# Altium schematic sheet 05_LMS7002M_RF1.SchDoc: LMS7002M RF
size A3; Organization: Lime Microsystems; Address1: Surrey Tech Centre; Address2: Guildford GU2 7YG; Address3: Surrey; Address4: United Kingdom; Revision: v1.4; SheetNumber: 5; SheetTotal: 15
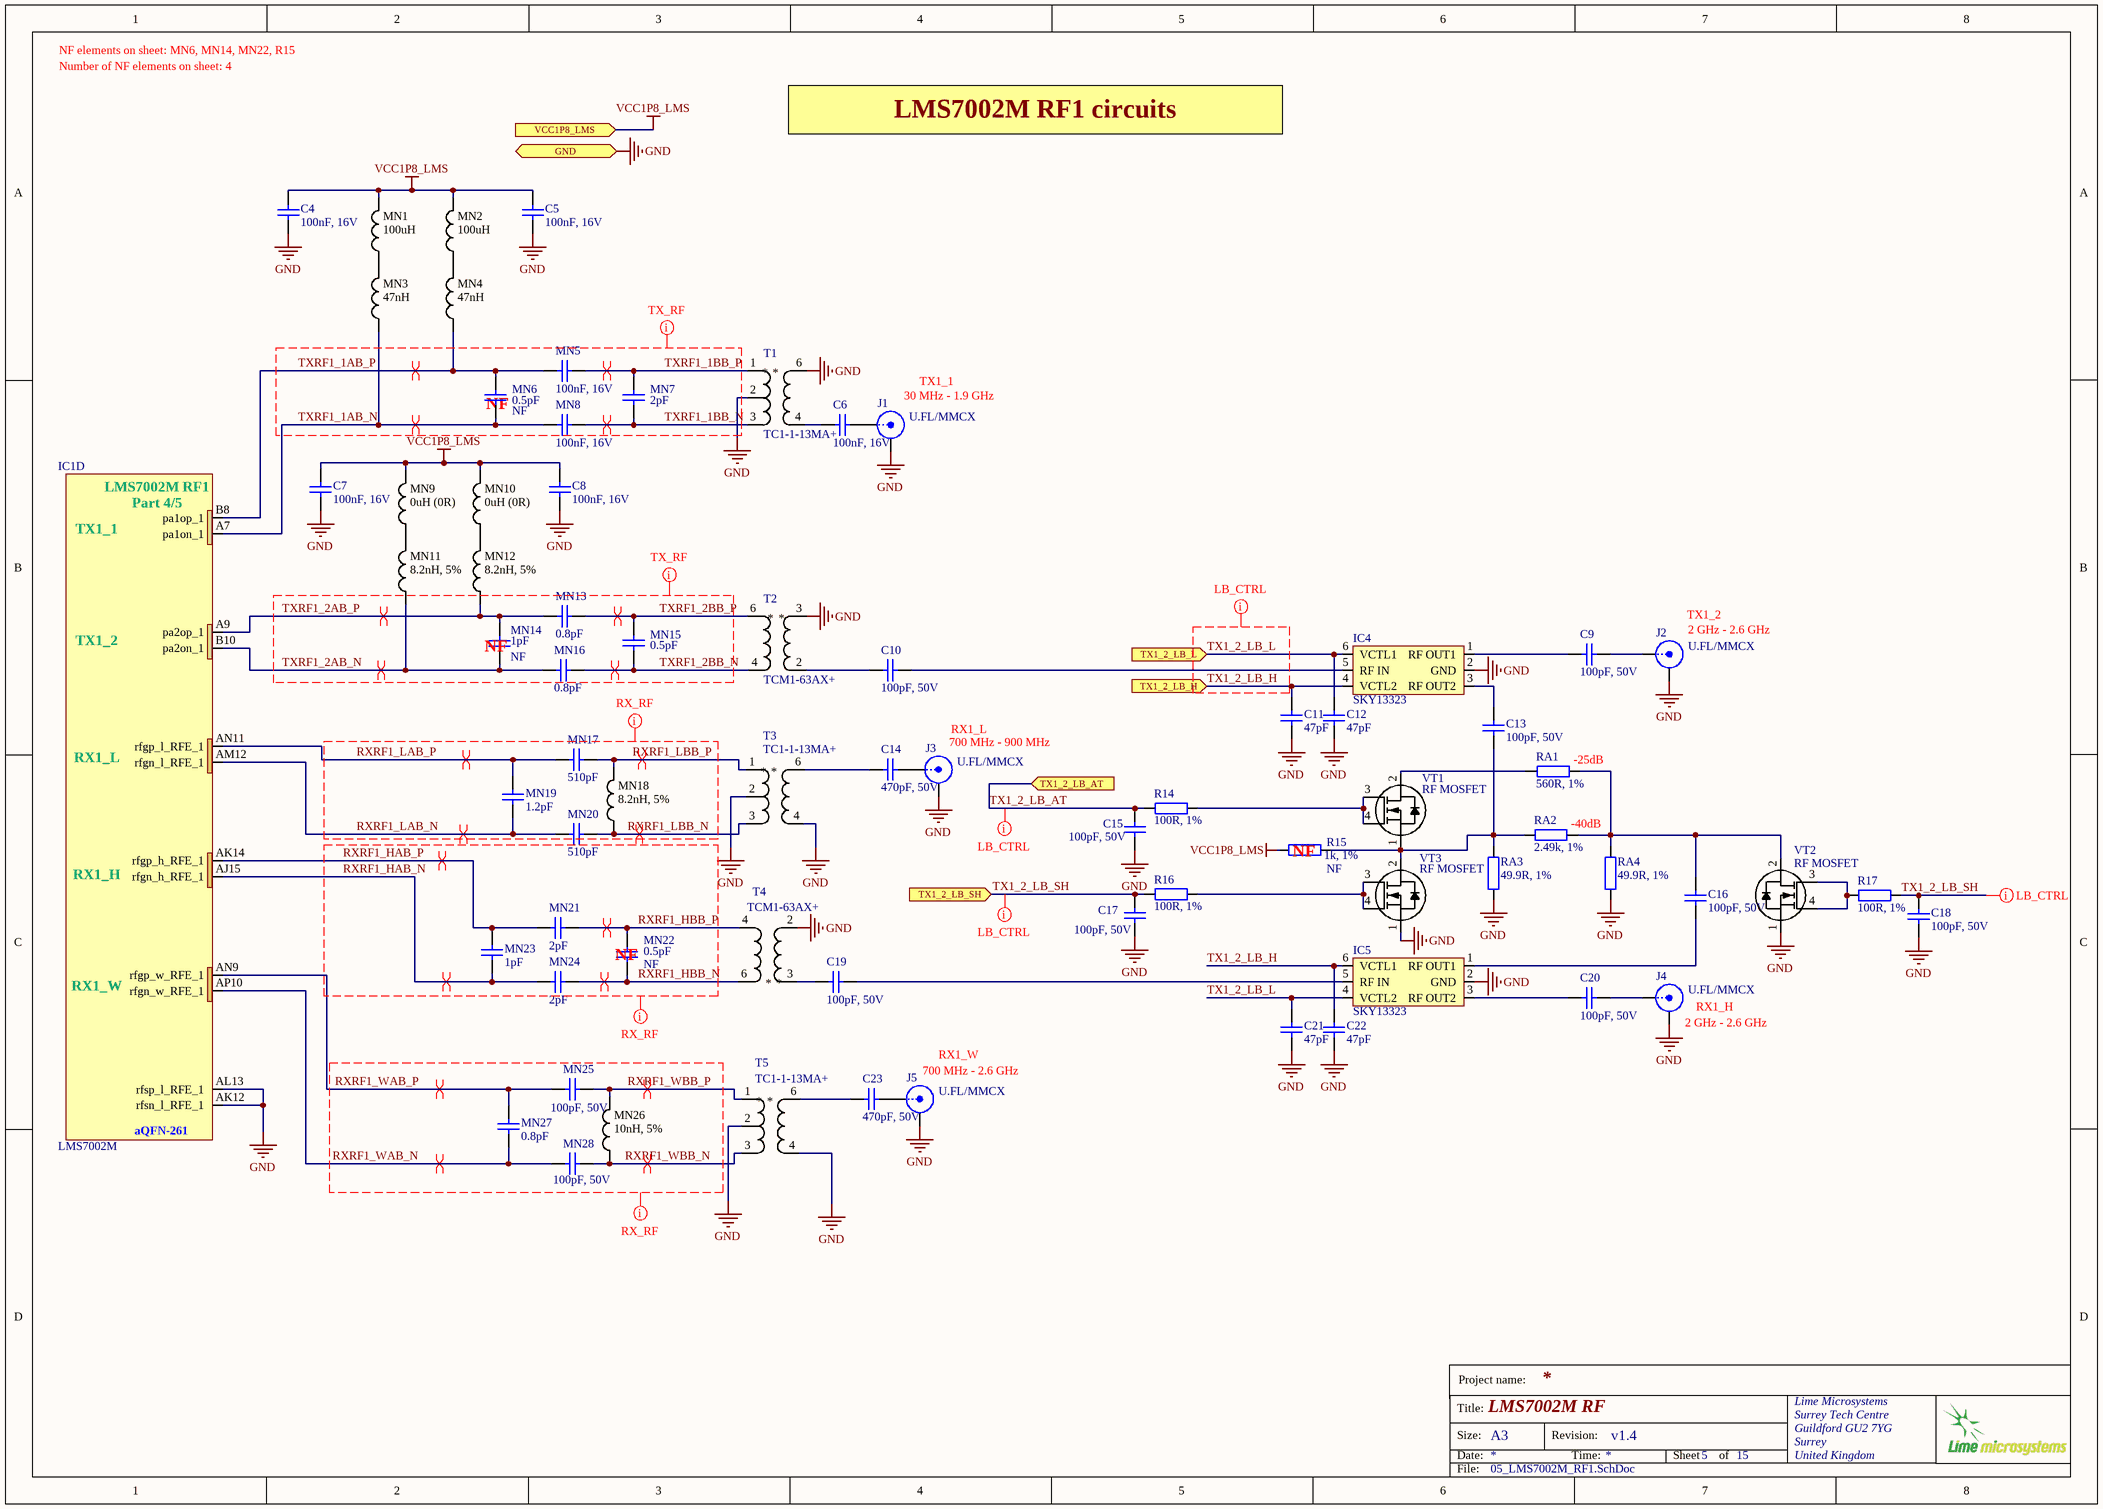
[diagram p0: 05_LMS7002M_RF1.SchDoc]

## Parts
C4  100nF, 16V  [CAP0402]
C5  100nF, 16V  [CAP0402]
C6  100nF, 16V  [CAP0402]
C7  100nF, 16V  [CAP0402]
C8  100nF, 16V  [CAP0402]
C9  100pF, 50V  [CAP0402]
C10  100pF, 50V  [CAP0402]
C11  47pF  [CAP0402]
C12  47pF  [CAP0402]
C13  100pF, 50V  [CAP0402]
C14  470pF, 50V  [CAP0402]
C15  100pF, 50V  [CAP0402]
C16  100pF, 50V  [CAP0402]
C17  100pF, 50V  [CAP0402]
C18  100pF, 50V  [CAP0402]
C19  100pF, 50V  [CAP0402]
C20  100pF, 50V  [CAP0402]
C21  47pF  [CAP0402]
C22  47pF  [CAP0402]
C23  470pF, 50V  [CAP0402]
IC1  LMS7002M  [LMS7002M_v3]  (part D of 5)
IC4  SKY13323  [SKY13323-378LF]
IC5  SKY13323  [SKY13323-378LF]
J1  U.FL/MMCX  [MMCX_UFL_conn_u]
J2  U.FL/MMCX  [MMCX_UFL_conn_u]
J3  U.FL/MMCX  [MMCX_UFL_conn_u]
J4  U.FL/MMCX  [MMCX_UFL_conn_u]
J5  U.FL/MMCX  [MMCX_UFL_conn_u]
MN1  100uH  [RES0805]
MN2  100uH  [RES0805]
MN3  47nH  [RES0402]
MN4  47nH  [RES0402]
MN5  100nF, 16V  [CAP0402]
MN6  0.5pF  Assembly Info: NF  [CAP0402]
MN7  2pF  [CAP0402]
MN8  100nF, 16V  [CAP0402]
MN9  0uH (0R)  [RES0805]
MN10  0uH (0R)  [RES0805]
MN11  8.2nH, 5%  [RES0402]
MN12  8.2nH, 5%  [RES0402]
MN13  0.8pF  [CAP0402]
MN14  1pF  Assembly Info: NF  [CAP0402]
MN15  0.5pF  [CAP0402]
MN16  0.8pF  [CAP0402]
MN17  510pF  [CAP0402]
MN18  8.2nH, 5%  [RES0402]
MN19  1.2pF  [CAP0402]
MN20  510pF  [CAP0402]
MN21  2pF  [CAP0402]
MN22  0.5pF  Assembly Info: NF  [CAP0402]
MN23  1pF  [CAP0402]
MN24  2pF  [CAP0402]
MN25  100pF, 50V  [CAP0402]
MN26  10nH, 5%  [RES0402]
MN27  0.8pF  [CAP0402]
MN28  100pF, 50V  [CAP0402]
R14  100R, 1%  [RES0402]
R15  1k, 1%  Assembly Info: NF  [RES0402]
R16  100R, 1%  [RES0402]
R17  100R, 1%  [RES0402]
RA1  560R, 1%  [RES0402]
RA2  2.49k, 1%  [RES0402]
RA3  49.9R, 1%  [RES0402]
RA4  49.9R, 1%  [RES0402]
T1  TC1-1-13MA+  [TC1-1-13MA+_v2]
T2  TCM1-63AX+  [TCM1-63AX+_v2]
T3  TC1-1-13MA+  [TC1-1-13MA+_v2]
T4  TCM1-63AX+  [TCM1-63AX+_v2]
T5  TC1-1-13MA+  [TC1-1-13MA+_v2]
VT1  RF MOSFET  [BF1105R_SOT143R4]
VT2  RF MOSFET  [BF1105R_SOT143R4]
VT3  RF MOSFET  [BF1105R_SOT143R4]

## Ports
GND, TX1_2_LB_AT (in), TX1_2_LB_H (in), TX1_2_LB_L (in), TX1_2_LB_SH (in), VCC1P8_LMS (in)

## Nets
GND: C4.1 C5.1 C7.1 C8.1 C11.1 C12.1 C15.2 C17.2 C18.2 C21.1 C22.1 IC1.AK12(rfsn_l_RFE_1) IC1.AL13(rfsp_l_RFE_1) IC4.2(GND) IC5.2(GND) J1.2(Y) J2.2(Y) J3.2(Y) J4.2(Y) J5.2(Y) RA3.1 RA4.1 T1.2 T1.6 T2.3 T3.2 T3.4 T4.2 T5.2 T5.4 VT2.1(S) VT3.1(S) ; port GND
VCC1P8_LMS: C4.2 C5.2 C7.2 C8.2 MN1.2 MN2.2 MN9.2 MN10.2 R15.2 ; port VCC1P8_LMS
RXRF1_HAB_N: IC1.AJ15(rfgn_h_RFE_1) MN23.1 MN24.2
RXRF1_HAB_P: IC1.AK14(rfgp_h_RFE_1) MN21.2 MN23.2
RXRF1_HBB_N: MN22.1 MN24.1 T4.6
RXRF1_HBB_P: MN21.1 MN22.2 T4.4
RXRF1_LAB_N: IC1.AM12(rfgn_l_RFE_1) MN19.1 MN20.2
RXRF1_LAB_P: IC1.AN11(rfgp_l_RFE_1) MN17.2 MN19.2
RXRF1_LBB_N: MN18.1 MN20.1 T3.3
RXRF1_LBB_P: MN17.1 MN18.2 T3.1
RXRF1_WAB_N: IC1.AP10(rfgn_w_RFE_1) MN27.2 MN28.2
RXRF1_WAB_P: IC1.AN9(rfgp_w_RFE_1) MN25.2 MN27.1
RXRF1_WBB_N: MN26.1 MN28.1 T5.3
RXRF1_WBB_P: MN25.1 MN26.2 T5.1
TX1_2_LB_AT: C15.1 R14.2 ; port TX1_2_LB_AT
TX1_2_LB_H: C11.2 C22.2 IC4.4(VCTL2) IC5.6(VCTL1) ; port TX1_2_LB_H
TX1_2_LB_L: C12.2 C21.2 IC4.6(VCTL1) IC5.4(VCTL2) ; port TX1_2_LB_L
TX1_2_LB_SH: C17.1 C18.1 R16.2 R17.1 ; port TX1_2_LB_SH
TXRF1_1AB_N: IC1.A7(pa1on_1) MN3.1 MN6.1 MN8.1
TXRF1_1AB_P: IC1.B8(pa1op_1) MN4.1 MN5.2 MN6.2
TXRF1_1BB_N: MN7.1 MN8.2 T1.3
TXRF1_1BB_P: MN5.1 MN7.2 T1.1
TXRF1_2AB_N: IC1.B10(pa2on_1) MN11.1 MN14.2 MN16.2
TXRF1_2AB_P: IC1.A9(pa2op_1) MN12.1 MN13.2 MN14.1
TXRF1_2BB_N: MN15.1 MN16.1 T2.4
TXRF1_2BB_P: MN13.1 MN15.2 T2.6
NetC6_1: C6.1 J1.1(X)
NetC6_2: C6.2 T1.4
NetC9_1: C9.1 J2.1(X)
NetC9_2: C9.2 IC4.1(RF_OUT1)
NetC10_1: C10.1 IC4.5(RF_IN)
NetC10_2: C10.2 T2.2
NetC13_1: C13.1 IC4.3(RF_OUT2)
NetC13_2: C13.2 R15.1 RA2.1 RA3.2 VT1.1(S) VT3.2(D)
NetC14_1: C14.1 J3.1(X)
NetC14_2: C14.2 T3.6
NetC16_1: C16.1 RA1.1 RA2.2 RA4.2 VT2.2(D)
NetC16_2: C16.2 IC5.1(RF_OUT1)
NetC19_1: C19.1 IC5.5(RF_IN)
NetC19_2: C19.2 T4.3
NetC20_1: C20.1 J4.1(X)
NetC20_2: C20.2 IC5.3(RF_OUT2)
NetC23_1: C23.1 J5.1(X)
NetC23_2: C23.2 T5.6
NetMN1_1: MN1.1 MN3.2
NetMN2_1: MN2.1 MN4.2
NetMN9_1: MN9.1 MN11.2
NetMN10_1: MN10.1 MN12.2
NetR14_1: R14.1 VT1.3(G2) VT1.4(G1)
NetR16_1: R16.1 VT3.3(G2) VT3.4(G1)
NetR17_2: R17.2 VT2.3(G2) VT2.4(G1)
NetRA1_2: RA1.2 VT1.2(D)

## Layout directives
differential pair: RXRF1_HAB_N, RXRF1_HAB_P, RXRF1_HBB_N, RXRF1_HBB_P, RXRF1_LAB_N, RXRF1_LAB_P, RXRF1_LBB_N, RXRF1_LBB_P, RXRF1_WAB_N, RXRF1_WAB_P, RXRF1_WBB_N, RXRF1_WBB_P, TXRF1_1AB_N, TXRF1_1AB_P, TXRF1_1BB_N, TXRF1_1BB_P, TXRF1_2AB_N, TXRF1_2AB_P, TXRF1_2BB_N, TXRF1_2BB_P
net class TX_RF: TXRF1_1AB_N, TXRF1_1AB_P, TXRF1_1BB_N, TXRF1_1BB_P, TXRF1_2AB_N, TXRF1_2AB_P, TXRF1_2BB_N, TXRF1_2BB_P
net class RX_RF: RXRF1_HAB_N, RXRF1_HAB_P, RXRF1_HBB_N, RXRF1_HBB_P, RXRF1_LAB_N, RXRF1_LAB_P, RXRF1_LBB_N, RXRF1_LBB_P, RXRF1_WAB_N, RXRF1_WAB_P, RXRF1_WBB_N, RXRF1_WBB_P
net class LB_CTRL: TX1_2_LB_AT, TX1_2_LB_H, TX1_2_LB_L, TX1_2_LB_SH

## Notes on the sheet
- Number of NF elements on sheet: 4
- NF elements on sheet: MN6, MN14, MN22, R15
- LMS7002M RF1 circuits
- (near J1) TX1_1
- (near MN6) NF
- (near J1) 30 MHz - 1.9 GHz
- (near MN14) NF
- (near J2) TX1_2
- (near J2) 2 GHz - 2.6 GHz
- (near J3) 700 MHz - 900 MHz
- (near J3) RX1_L
- (near RA1) -25dB
- (near R15) NF
- (near RA2) -40dB
- (near MN22) NF
- (near J5) RX1_W
- (near J4) 2 GHz - 2.6 GHz
- (near J4) RX1_H
- (near J5) 700 MHz - 2.6 GHz
- Project name:
- Title:
- Size:
- Date:
- A3
- Revision:
- Time:
- Sheet
- of
- File:
- (in symbol LMS7002M, part D) LMS7002M RF1; Part 4/5; TX1_1; TX1_2; RX1_L; RX1_H; RX1_W; aQFN-261

## Library data of the parts
C4-C8 = Cap_0402: Manufacturer: Murata Electronics; Manufacturer Part Number: GRM155R71C104KA88D; Part Description: 0.10µF ±10% 16V X7R Ceramic Capacitor -55°C ~ 125°C Surface Mount, MLCC 0402 (1005 Metric) 0.039" L x 0.020" W (1.00mm x 0.50mm); Tolerance: 10 %; Type: General Purpose MLCC; Capacitance: 0.1 uF; Case Length: 1 mm; Dielectric: X7R; Case Height: 0.5 mm; Temperature Coefficient / Code: +/- 15 %; Value: 100nF, 16V; Supplier 1: Mouser; Supplier Part Number 1: 81-GRM155R71C104KA88; Case Code - in: 0402; RoHS: RoHS Compliant; Operating Temperature Range: - 55 C to + 125 C; Series: GRM; Termination Style: SMD/SMT; Package / Case: 0402 (1005 metric); Voltage Rating DC: 16 V; Maximum Operating Temperature: + 125 C; Case Code - mm: 1005; Minimum Operating Temperature: - 55 C; Product Category: Low & Medium Capacitance SMD Ceramic Chip Capacitors; Packaging: Reel; Product: General Type MLCCs; Category: Multilayer Ceramic Capacitors MLCC - SMD/SMT; Brand: Murata Electronics; Case Width: 0.5 mm; RoHS - Mouser: Y; Standard Pack Qty: 10000; Minimum Order Quantity: 1; Reeling: True; Manufacturer Part Number 1: GRM155R71C104KA88D
C9 C10 C13 C15-C20 MN25 MN28 = Cap_0402: Manufacturer Part Number 1: CC0402JRNPO9BN101; Manufacturer: Yageo; Part Description: 100pF ±5% 50V C0G, NP0 Ceramic Capacitor -55°C ~ 125°C Surface Mount, MLCC 0402 (1005 Metric) 0.039" L x 0.020" W (1.00mm x 0.50mm); Tolerance: ±5%; Temperature Coefficient: C0G, NP0; Value: 100pF, 50V; Capacitance: 100pF; Thickness (Max): 0.022" (0.55mm); Size / Dimension: 0.039" L x 0.020" W (1.00mm x 0.50mm); RoHS: RoHS Compliant; Ratings: -; Package / Case: 0402 (1005 Metric); Mounting Type: Surface Mount, MLCC; Height - Seated (Max): -; Features: -; Lead Spacing: -; Voltage - Rated: 50V; Operating Temperature: -55°C ~ 125°C; Packaging: Cut Tape (CT); Applications: General Purpose; Lead Style: -; Supplier 1: Digi-Key; Category: Capacitors; Supplier Part Number 1: 311-1024-1-ND
C11 C12 C21 C22 = Cap_0402: Manufacturer Part Number 1: C1005C0G1H470F050BA; Manufacturer: TDK Corporation; Part Description: 47pF ±1% 50V C0G, NP0 Ceramic Capacitor -55°C ~ 125°C Surface Mount, MLCC 0402 (1005 Metric) 0.039" L x 0.020" W (1.00mm x 0.50mm); Voltage - Rated: 50V; Temperature Coefficient: C0G, NP0; Tolerance: ±1%; Value: 47pF; Supplier 1: Digi-Key; Supplier Part Number 1: 445-5361-1-ND; Package / Case: 0402 (1005 Metric); Lead Spacing: -; Ratings: -; Mounting Type: Surface Mount, MLCC; Operating Temperature: -55°C ~ 125°C; Thickness (Max): 0.022" (0.55mm); Capacitance: 47pF; Packaging: Cut Tape (CT); Features: -; Applications: General Purpose; Lead Style: -; Size / Dimension: 0.039" L x 0.020" W (1.00mm x 0.50mm); Height - Seated (Max): -; RoHS: RoHS Compliant; Category: Capacitors
C14 C23 = Cap_0402: Manufacturer Part Number: C1005C0G1H471J050BA; Manufacturer: TDK Corporation; Part Description: 470pF ±5% 50V C0G, NP0 Ceramic Capacitor -55°C ~ 125°C Surface Mount, MLCC 0402 (1005 Metric) 0.039" L x 0.020" W (1.00mm x 0.50mm); Tolerance: ±5%; Temperature Coefficient: C0G, NP0; Value: 470pF, 50V; Supplier 1: Digi-Key; Supplier Part Number 1: 445-2656-6-ND; Ratings: -; Package / Case: 0402 (1005 Metric); Capacitance: 470pF; Packaging: Digi-Reel®; RoHS: RoHS Compliant; Lead Style: -; Thickness (Max): 0.022" (0.55mm); Size / Dimension: 0.039" L x 0.020" W (1.00mm x 0.50mm); Lead Spacing: -; Operating Temperature: -55°C ~ 125°C; Height - Seated (Max): -; Applications: General Purpose; Mounting Type: Surface Mount, MLCC; Voltage - Rated: 50V; Category: Capacitors; Features: -
IC1 = LMS7002M: Part Description: IC FPRF Transceiver LMS7002M; 261 pin aQFN; Manufacturer: Lime Microsystems; Manufacturer Part Number 1: LMS7002M; Supplier 1: Lime Microsystems; Supplier Part Number 1: LMS7002M
IC4 IC5 = SKY13323: SKY13323-378LF: 0.1-3.0 GHz GaAs SPDT Switch; Manufacturer: Skyworks Solutions Inc.; Part Description: IC SPDT 100MHZ-3GHZ 6-MLPD; Frequency - Lower: 100MHz; P1dB: 27dBm (typ) IP1dB; Isolation @ Frequency: 27dB @ 3GHz (typ); RF Type: 802.11b/g; Impedance: 50 Ohm; IIP3: 50dBm (typ); Topology: Reflective; Insertion Loss @ Frequency: 0.35dB @ 3GHz; Frequency - Upper: 3GHz; Supplier 1: Digi-Key; Operating Temperature: -40°C ~ 85°C; RoHS: RoHS Compliant; Package / Case: 6-XFDFN Exposed Pad; Circuit: SPDT; Features: -; Supplier Device Package: 6-MLPD (1x1); Category: RF/IF and RFID; Packaging: Cut Tape (CT); Manufacturer Part Number 1: SKY13323-378LF; Supplier Part Number 1: 683-1334-1-ND
J1-J5 = RF_IF_connector: CONN UMC RCPT STR 50 OHM SMD; Manufacturer: Molex, LLC; Manufacturer Part Number 1: 0734120110; Body Finish: Nickel; Body Material: Phosphor Bronze; Center Contact Material: Brass; Center Contact Plating: Gold; Connector Style: Ultra Miniature Coaxial; Connector Type: Jack, Male Pin; Contact Termination: Solder; Dielectric Material: Liquid Crystal Polymer (LCP); Frequency - Max: 6GHz; Impedance: 50 Ohm; Voltage Rating: 60V; Cable Group: -; Category: Connectors, Interconnects; Fastening Type: Snap-On; Features: -; Housing Color: Silver; Ingress Protection: -; Mounting Type: Surface Mount; Operating Temperature: -40°C ~ 90°C; Packaging: Cut Tape (CT); RoHS: RoHS Compliant; Shield Termination: Solder; Supplier 1: Digi-Key; Supplier Part Number 1: WM5587CT-ND; Part Description: CONN UMC RCPT STR 50 OHM SMD
MN1 MN2 = Inductor_0603: Manufacturer: TDK Corporation; Manufacturer Part Number: MLF2012C101KT000; Part Description: FIXED IND 100UH 2MA 3.1 OHM SMD; Q @ Freq: 25 @ 1MHz; Shielding: Shielded; Current Rating: 2mA; Frequency - Self Resonant: 7MHz; Frequency - Test: 1MHz; Material - Core: Ferrite; Tolerance: ±10%; Inductance: 100µH; DC Resistance (DCR): 3.1 Ohm Max; Value: 100uH; Supplier 1: Digi-Key; Supplier Part Number 1: 445-1071-1-ND; Supplier Device Package: 0805 (2012 Metric); Size / Dimension: 0.079" L x 0.049" W (2.00mm x 1.25mm); Operating Temperature: -40°C ~ 85°C; Packaging: Cut Tape (CT); RoHS: RoHS Compliant; Current - Saturation: -; Height - Seated (Max): 0.057" (1.45mm); Package / Case: 0805 (2012 Metric); Mounting Type: Surface Mount; Type: Multilayer; Category: Inductors, Coils, Chokes
MN3 MN4 = Inductor_0603: Manufacturer: COILCRAFT; Manufacturer Part Number: 0402HP-47NXJLU; Part Description: INDUCTOR, RF, 47NH, 5%, 2.4GHZ, SMD; Product Range:0402HP Series; Inductance:47nH; Inductance Tolerance:± 5%; High Frequency Inductor Case:0402 [1005 Metric]; Self Resonant Frequency Min:2.4GHz; DC Resistance Max:0.58ohm; DC Current Rating:420mA; SVHC: No SVHC (15-Jun-2015); Inductance Tolerance: ± 5%; High Frequency Inductor Case: 0402 [1005 Metric]; Inductor Case Style: 0402 [1005 Metric]<!--FANDB--><div class="features-and-benefits-container"></div>; Inductance: 47; DC Resistance Max: 0.58; Self Resonant Frequency Min: 2.4; Product Range: 0402; DC Current Rating: 420; Inductor Construction: Wirewound; Supplier 1: Farnell; Supplier Part Number 1: 2285856; Packaging: Cut Tape; RoHS: Y-EX; value: 47nH
MN5 MN8 = Cap_0402: Manufacturer: Murata Electronics; Manufacturer Part Number: GRM155R71C104KA88D; Part Description: 0.10µF ±10% 16V X7R Ceramic Capacitor -55°C ~ 125°C Surface Mount, MLCC 0402 (1005 Metric) 0.039" L x 0.020" W (1.00mm x 0.50mm); Tolerance: 10 %; Capacitance: 0.1 uF; Case Length: 1 mm; Dielectric: X7R; Case Height: 0.5 mm; Temperature Coefficient / Code: +/- 15 %; Value: 100nF, 16V; Supplier 1: Mouser; Supplier Part Number 1: 81-GRM155R71C104KA88; Case Code - in: 0402; RoHS: RoHS Compliant; Operating Temperature Range: - 55 C to + 125 C; Series: GRM; Termination Style: SMD/SMT; Package / Case: 0402 (1005 metric); Voltage Rating DC: 16 V; Type: General Purpose MLCC; Maximum Operating Temperature: + 125 C; Case Code - mm: 1005; Minimum Operating Temperature: - 55 C; Product Category: Low & Medium Capacitance SMD Ceramic Chip Capacitors; Packaging: Reel; Product: General Type MLCCs; Category: Multilayer Ceramic Capacitors MLCC - SMD/SMT; Brand: Murata Electronics; Case Width: 0.5 mm; RoHS - Mouser: Y; Standard Pack Qty: 10000; Minimum Order Quantity: 1; Reeling: True; Manufacturer Part Number 1: GRM155R71C104KA88D
MN6 MN15 MN22 = Cap_0402: Manufacturer: Yageo; Manufacturer Part Number 1: CC0402CRNPO9BNR50; Part Description: 0.50pF ±0.25pF 50V C0G, NP0 Ceramic Capacitor -55°C ~ 125°C Surface Mount, MLCC 0402 (1005 Metric) 0.039" L x 0.020" W (1.00mm x 0.50mm); Capacitance: 0.50pF; Voltage - Rated: 50V; Temperature Coefficient: C0G, NP0; Tolerance: ±0.25pF; Value: 0.5pF; Supplier 1: Digi-Key; Supplier Part Number 1: 311-1001-1-ND; RoHS: RoHS Compliant; Thickness (Max): 0.022" (0.55mm); Features: -; Height - Seated (Max): -; Lead Spacing: -; Applications: General Purpose; Packaging: Cut Tape (CT); Ratings: -; Size / Dimension: 0.039" L x 0.020" W (1.00mm x 0.50mm); Lead Style: -; Mounting Type: Surface Mount, MLCC; Operating Temperature: -55°C ~ 125°C; Package / Case: 0402 (1005 Metric); Category: Capacitors
MN7 MN21 MN24 = Cap_0402: Manufacturer Part Number: 04025U2R0BAT2A; Manufacturer: AVX; Part Description: 2pF ±0.1pF 50V C0G, NP0 Ceramic Capacitor -55°C ~ 125°C Surface Mount, MLCC 0402 (1005 Metric) 0.039" L x 0.020" W (1.00mm x 0.50mm); Product Range: U Series; Voltage Rating: 50; SVHC: No SVHC (17-Dec-2014); Capacitance Tolerance: ± 0.1; Ceramic Capacitor Case: 0402 [1005 Metric]; Capacitance: 2; Dielectric Characteristic: C0G / NP0; Value: 2pF; Supplier 1: Farnell; Supplier Part Number 1: 2332536; Operating Temperature Max: 125; RoHS: YES; Operating Temperature Min: -55; Capacitance Tolerance ±: ± 0.1; Packaging: Cut Tape; MSL: MSL 1 - Unlimited
MN9 MN10 = Inductor_0603: Manufacturer: BOURNS; Manufacturer Part Number 1: CR0805-J/-000ELF; Part Description: RES SMD 0.0 OHM JUMPER 1/8W 0805; Value: 0uH (0R); Supplier 1: Farnell; Supplier Part Number 1: 2008388; RoHS: YES
MN11 MN12 MN18 = Inductor_0603: Manufacturer: COILCRAFT; Manufacturer Part Number 1: 0402HP-8N2XJLU; Part Description: INDUCTOR, RF, 8.2NH, 5%, 5.4GHZ, SMD; Product Range:0402HP Series; Inductance:8.2nH; Inductance Tolerance:± 5%; High Frequency Inductor Case:0402 [1005 Metric]; Self Resonant Frequency Min:5.4GHz; DC Resistance Max:0.065ohm; DC Current Rating:1.5A; Inductor Construction: Wirewound; DC Current Rating: 1.5; Inductor Case Style: 0402 [1005 Metric]<!--FANDB--><div class="features-and-benefits-container"></div>; Self Resonant Frequency Min: 5.4; DC Resistance Max: 0.065; High Frequency Inductor Case: 0402 [1005 Metric]; SVHC: No SVHC (16-Jun-2014); Inductance: 8.2; Supplier 1: Farnell; Supplier Part Number 1: 2285826; Packaging: Cut Tape; Product Range: COILCRAFT - 0402; Inductance Tolerance: ± 5%; RoHS: Y-EX; Value: 8.2nH, 5%
MN13 MN16 MN27 = Cap_0402: Manufacturer: Murata Electronics North America; Manufacturer Part Number: GRM1555C1HR80BA01D; Part Description: 0.80pF ±0.1pF 50V C0G, NP0 Ceramic Capacitor -55°C ~ 125°C Surface Mount, MLCC 0402 (1005 Metric) 0.039" L x 0.020" W (1.00mm x 0.50mm); Temperature Coefficient: C0G, NP0; Capacitance: 0.80pF; Voltage - Rated: 50V; Tolerance: ±0.1pF; Value: 0.8pF; Applications: General Purpose; Operating Temperature: -55°C ~ 125°C; Size / Dimension: 0.039" L x 0.020" W (1.00mm x 0.50mm); Features: -; Supplier 1: Digi-Key; Height - Seated (Max): -; Category: Capacitors; Package / Case: 0402 (1005 Metric); Mounting Type: Surface Mount, MLCC; Lead Spacing: -; Thickness (Max): 0.022" (0.55mm); RoHS: RoHS Compliant; Supplier Part Number 1: 490-6269-1-ND; Packaging: Cut Tape (CT); Ratings: -; Lead Style: -
MN14 MN23 = Cap_0402: Manufacturer: TDK Corporation; Manufacturer Part Number 1: C1005C0G1H010B050BA; Part Description: 1pF ±0.1pF 50V C0G, NP0 Ceramic Capacitor -55°C ~ 125°C Surface Mount, MLCC 0402 (1005 Metric) 0.039" L x 0.020" W (1.00mm x 0.50mm); Voltage - Rated: 50V; Temperature Coefficient: C0G, NP0; Tolerance: ±0.1pF; Value: 1pF; Supplier 1: Digi-Key; Supplier Part Number 1: 445-4854-6-ND; Size / Dimension: 0.039" L x 0.020" W (1.00mm x 0.50mm); Lead Spacing: -; Operating Temperature: -55°C ~ 125°C; Thickness (Max): 0.022" (0.55mm); Package / Case: 0402 (1005 Metric); Features: -; Lead Style: -; Applications: General Purpose; Height - Seated (Max): -; Capacitance: 1pF; RoHS: RoHS Compliant; Mounting Type: Surface Mount, MLCC; Packaging: Digi-Reel®; Ratings: -; Category: Capacitors
MN17 MN20 = Cap_0402: Manufacturer: Murata Electronics North America; Manufacturer Part Number: GRM1555C1H511JA01D; Part Description: 510pF ±5% 50V C0G, NP0 Ceramic Capacitor -55°C ~ 125°C Surface Mount, MLCC 0402 (1005 Metric) 0.039" L x 0.020" W (1.00mm x 0.50mm); Voltage - Rated: 50V; Temperature Coefficient: C0G, NP0; Tolerance: ±5%; Value: 510pF; Supplier 1: Digi-Key; Supplier Part Number 1: 490-3237-1-ND; Height - Seated (Max): -; Features: -; Size / Dimension: 0.039" L x 0.020" W (1.00mm x 0.50mm); Applications: General Purpose; Lead Spacing: -; Package / Case: 0402 (1005 Metric); Ratings: -; Thickness (Max): 0.022" (0.55mm); Lead Style: -; Operating Temperature: -55°C ~ 125°C; Mounting Type: Surface Mount, MLCC; Capacitance: 510pF; Category: Capacitors; RoHS: RoHS Compliant; Packaging: Cut Tape (CT)
MN19 = Cap_0402: Manufacturer: Murata Electronics North America; Manufacturer Part Number: GRM1555C1H1R2CA01D; Part Description: 1.2pF ±0.25pF 50V C0G, NP0 Ceramic Capacitor -55°C ~ 125°C Surface Mount, MLCC 0402 (1005 Metric) 0.039" L x 0.020" W (1.00mm x 0.50mm); Temperature Coefficient: C0G, NP0; Voltage - Rated: 50V; Tolerance: ±0.25pF; Value: 1.2pF; Supplier 1: Digi-Key; Supplier Part Number 1: 490-5927-1-ND; Lead Style: -; Category: Capacitors; Features: -; Packaging: Cut Tape (CT); Operating Temperature: -55°C ~ 125°C; Package / Case: 0402 (1005 Metric); Applications: General Purpose; Size / Dimension: 0.039" L x 0.020" W (1.00mm x 0.50mm); Lead Spacing: -; Ratings: -; Mounting Type: Surface Mount, MLCC; RoHS: RoHS Compliant; Height - Seated (Max): -; Thickness (Max): 0.022" (0.55mm); Capacitance: 1.2pF
MN26 = Inductor_0603: Manufacturer Part Number 1: 0402HP-10NXJLU; Manufacturer: COILCRAFT; Part Description: INDUCTOR, RF, 10NH, 5%, 4.7GHZ, SMD; Product Range:0402HP Series; Inductance:10nH; Inductance Tolerance:± 5%; High Frequency Inductor Case:0402 [1005 Metric]; Self Resonant Frequency Min:4.7GHz; DC Resistance Max:0.11ohm; DC Current Rating:1.3A; Value: 10nH, 5%; Supplier 1: Farnell; Supplier Part Number 1: 2285830; RoHS: Y-EX
R14 R16 R17 = Res_0402: Manufacturer Part Number 1: RMCF0402FT100R; Part Description: RES SMD 100 OHM 1% 1/16W 0402; Manufacturer: Stackpole Electronics Inc.; Temperature Coefficient: ±100ppm/°C; Supplier 1: Digi-Key; Supplier Part Number 1: RMCF0402FT100RDKR-ND; Package / Case: 0402 (1005 Metric); Composition: Thick Film; Category: Resistors; Tolerance: ±1%; Value: 100R, 1%
R15 = Res_0402: Manufacturer: Stackpole Electronics Inc; Manufacturer Part Number 1: RMCF0402FT1K00; Part Description: RES SMD 1K OHM 1% 1/16W 0402; Temperature Coefficient: ±100ppm/°C; Power (Watts): 0.063W, 1/16W; Value: 1k, 1%; Supplier 1: Digi-Key; Supplier Part Number 1: RMCF0402FT1K00TR-ND; Resistance (Ohms): 1k; Packaging: Tape & Reel (TR); Category: Resistors; RoHS: RoHS Compliant; Tolerance: ±1%; Height: 0.016" (0.40mm); Number of Terminations: 2; Package / Case: 0402 (1005 Metric); Operating Temperature: -55°C ~ 155°C; Features: -; Composition: Thick Film; Supplier Device Package: 0402; Size / Dimension: 0.039" L x 0.020" W (1.00mm x 0.50mm)
RA1 = Res_0402: Manufacturer Part Number: CRCW0402560RFKED; Manufacturer: Vishay Dale; Part Description: RES SMD 560 OHM 1% 1/16W 0402; Resistance (Ohms): 560; Power (Watts): 0.063W, 1/16W; Temperature Coefficient: ±100ppm/°C; RoHS: RoHS Compliant; Packaging: Cut Tape (CT); Composition: Thick Film; Tolerance: ±1%; Number of Terminations: 2; Supplier Device Package: 0402 (1005 Metric); Operating Temperature: -55°C ~ 155°C; Features: Automotive AEC-Q200; Category: Resistors; Supplier Part Number 1: 541-560LCT-ND; Package / Case: 0402 (1005 Metric); Supplier 1: Digi-Key; Height: 0.016" (0.40mm); Size / Dimension: 0.039" L x 0.020" W (1.00mm x 0.50mm)
RA2 = Res_0402: Manufacturer Part Number: RC0402FR-072K49L; Manufacturer: Yageo; Part Description: RES SMD 2.49K OHM 1% 1/16W 0402; Temperature Coefficient: ±100ppm/°C; Power (Watts): 0.063W, 1/16W; Value: 2.49k, 1%; Size / Dimension: 0.039" L x 0.020" W (1.00mm x 0.50mm); Height: 0.016" (0.40mm); Features: Moisture Resistant; Resistance (Ohms): 2.49k; Operating Temperature: -55°C ~ 155°C; Tolerance: ±1%; Composition: Thick Film; Supplier Device Package: 0402; Package / Case: 0402 (1005 Metric); Number of Terminations: 2; Category: Resistors; Packaging: Digi-Reel®; Supplier Part Number 1: 311-2.49KLRDKR-ND; RoHS: RoHS Compliant; Supplier 1: Digi-Key
RA3 RA4 = Res_0402: Manufacturer: Samsung Electro-Mechanics America, Inc.; Manufacturer Part Number: RC1005F49R9CS; Part Description: RES SMD 49.9 OHM 1% 1/16W 0402; Temperature Coefficient: ±100ppm/°C; Resistance (Ohms): 49.9; Power (Watts): 0.063W, 1/16W; Number of Terminations: 2; Size / Dimension: 0.039" L x 0.020" W (1.00mm x 0.50mm); Supplier Device Package: 0402 (1005 Metric); RoHS: RoHS Compliant; Supplier Part Number 1: 1276-3469-6-ND; Features: -; Packaging: Digi-Reel®; Tolerance: ±1%; Height: 0.016" (0.40mm); Category: Resistors; Composition: Thick Film; Package / Case: 0402 (1005 Metric); Supplier 1: Digi-Key; Operating Temperature: -55°C ~ 155°C; Value: 49.9R, 1%
T1 T3 T5 = Balun: Manufacturer: Mini-Circuits; Part Description: RF balun, TC1-1-13MA+; Manufacturer Part Number 1: TC1-1-13MA+; Supplier Part Number 1: TC1-1-13MA+; Supplier 1: Minicircuits
T2 T4 = Balun_v2: Manufacturer: Mini-circuits; Part Description: RF balun, TCM1-63AX+; Supplier Part Number 1: TCM1-63AX+; Manufacturer Part Number 1: TCM1-63AX+; Supplier 1: Minicircuits
VT1-VT3 = BF1105R,215: Manufacturer: NXP Semiconductors; Part Description: RF MOSFET Transistors Trans MOSFET N-CH 7V 0.03A 4pin(3+Tab); Voltage - Rated: 7V; Noise Figure: 1.7dB; Current Rating: 30mA; Gain: 20dB; Transistor Type: N-Channel Dual Gate; Frequency: 800MHz; Voltage - Test: 5V; Supplier 1: Digi-Key; RoHS: RoHS Compliant; Supplier Device Package: SOT-143R; Power - Output: -; Current - Test: -; Manufacturer Part Number 1: BF1105R,215; Packaging: Digi-Reel®; Package / Case: SOT-143R; Category: Discrete Semiconductor Products; Supplier Part Number 1: 568-12530-6-ND